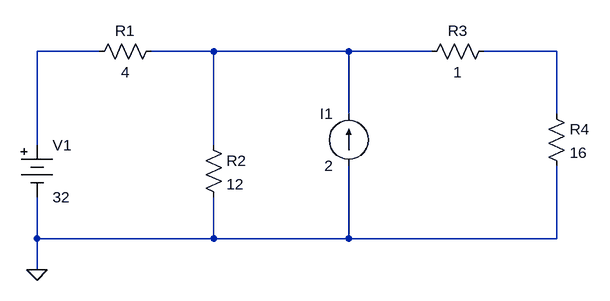
[diagram p0: schematic LAB_009_Thevenins_Theorem.asc]
LAB_009_Thevenins_Theorem.asc, the LTspice schematic file:
Version 4
SHEET 1 984 680
WIRE 224 -144 128 -144
WIRE 400 -144 304 -144
WIRE 608 -144 400 -144
WIRE 736 -144 608 -144
WIRE 928 -144 816 -144
WIRE 608 -48 608 -144
WIRE 928 -48 928 -144
WIRE 128 0 128 -144
WIRE 400 0 400 -144
WIRE 128 144 128 80
WIRE 400 144 400 80
WIRE 400 144 128 144
WIRE 608 144 608 32
WIRE 608 144 400 144
WIRE 928 144 928 32
WIRE 928 144 608 144
WIRE 128 192 128 144
FLAG 128 192 0
SYMBOL Misc\\battery 128 -16 R0
WINDOW 123 0 0 Left 0
WINDOW 39 0 0 Left 0
SYMATTR InstName V1
SYMATTR Value 32
SYMBOL res 320 -160 R90
WINDOW 0 0 56 VBottom 2
WINDOW 3 32 56 VTop 2
SYMATTR InstName R1
SYMATTR Value 4
SYMBOL res 384 -16 R0
SYMATTR InstName R2
SYMATTR Value 12
SYMBOL current 608 32 R180
WINDOW 0 24 80 Left 2
WINDOW 3 24 0 Left 2
SYMATTR InstName I1
SYMATTR Value 2
SYMBOL res 832 -160 R90
WINDOW 0 0 56 VBottom 2
WINDOW 3 32 56 VTop 2
SYMATTR InstName R3
SYMATTR Value 1
SYMBOL res 912 -64 R0
SYMATTR InstName R4
SYMATTR Value 16

The netlist it stands for:
* LAB_009_Thevenins_Theorem.asc
V1 N001 0 32
R1 N002 N001 4
R2 N002 0 12
I1 0 N002 2
R3 N003 N002 1
R4 N003 0 16
.backanno
.end